# EasyEDA Pro project 旋变解码板_v2.2.epro, schematic schematic1_7

## Sheets
1 MCU: Create Date: 2024-06-20; Page Name: MCU; Project Name: underwaterJointControlBoard_0430; Schematic Name: schematic1_6; Update Date: 2024-06-20; Page Size: A4
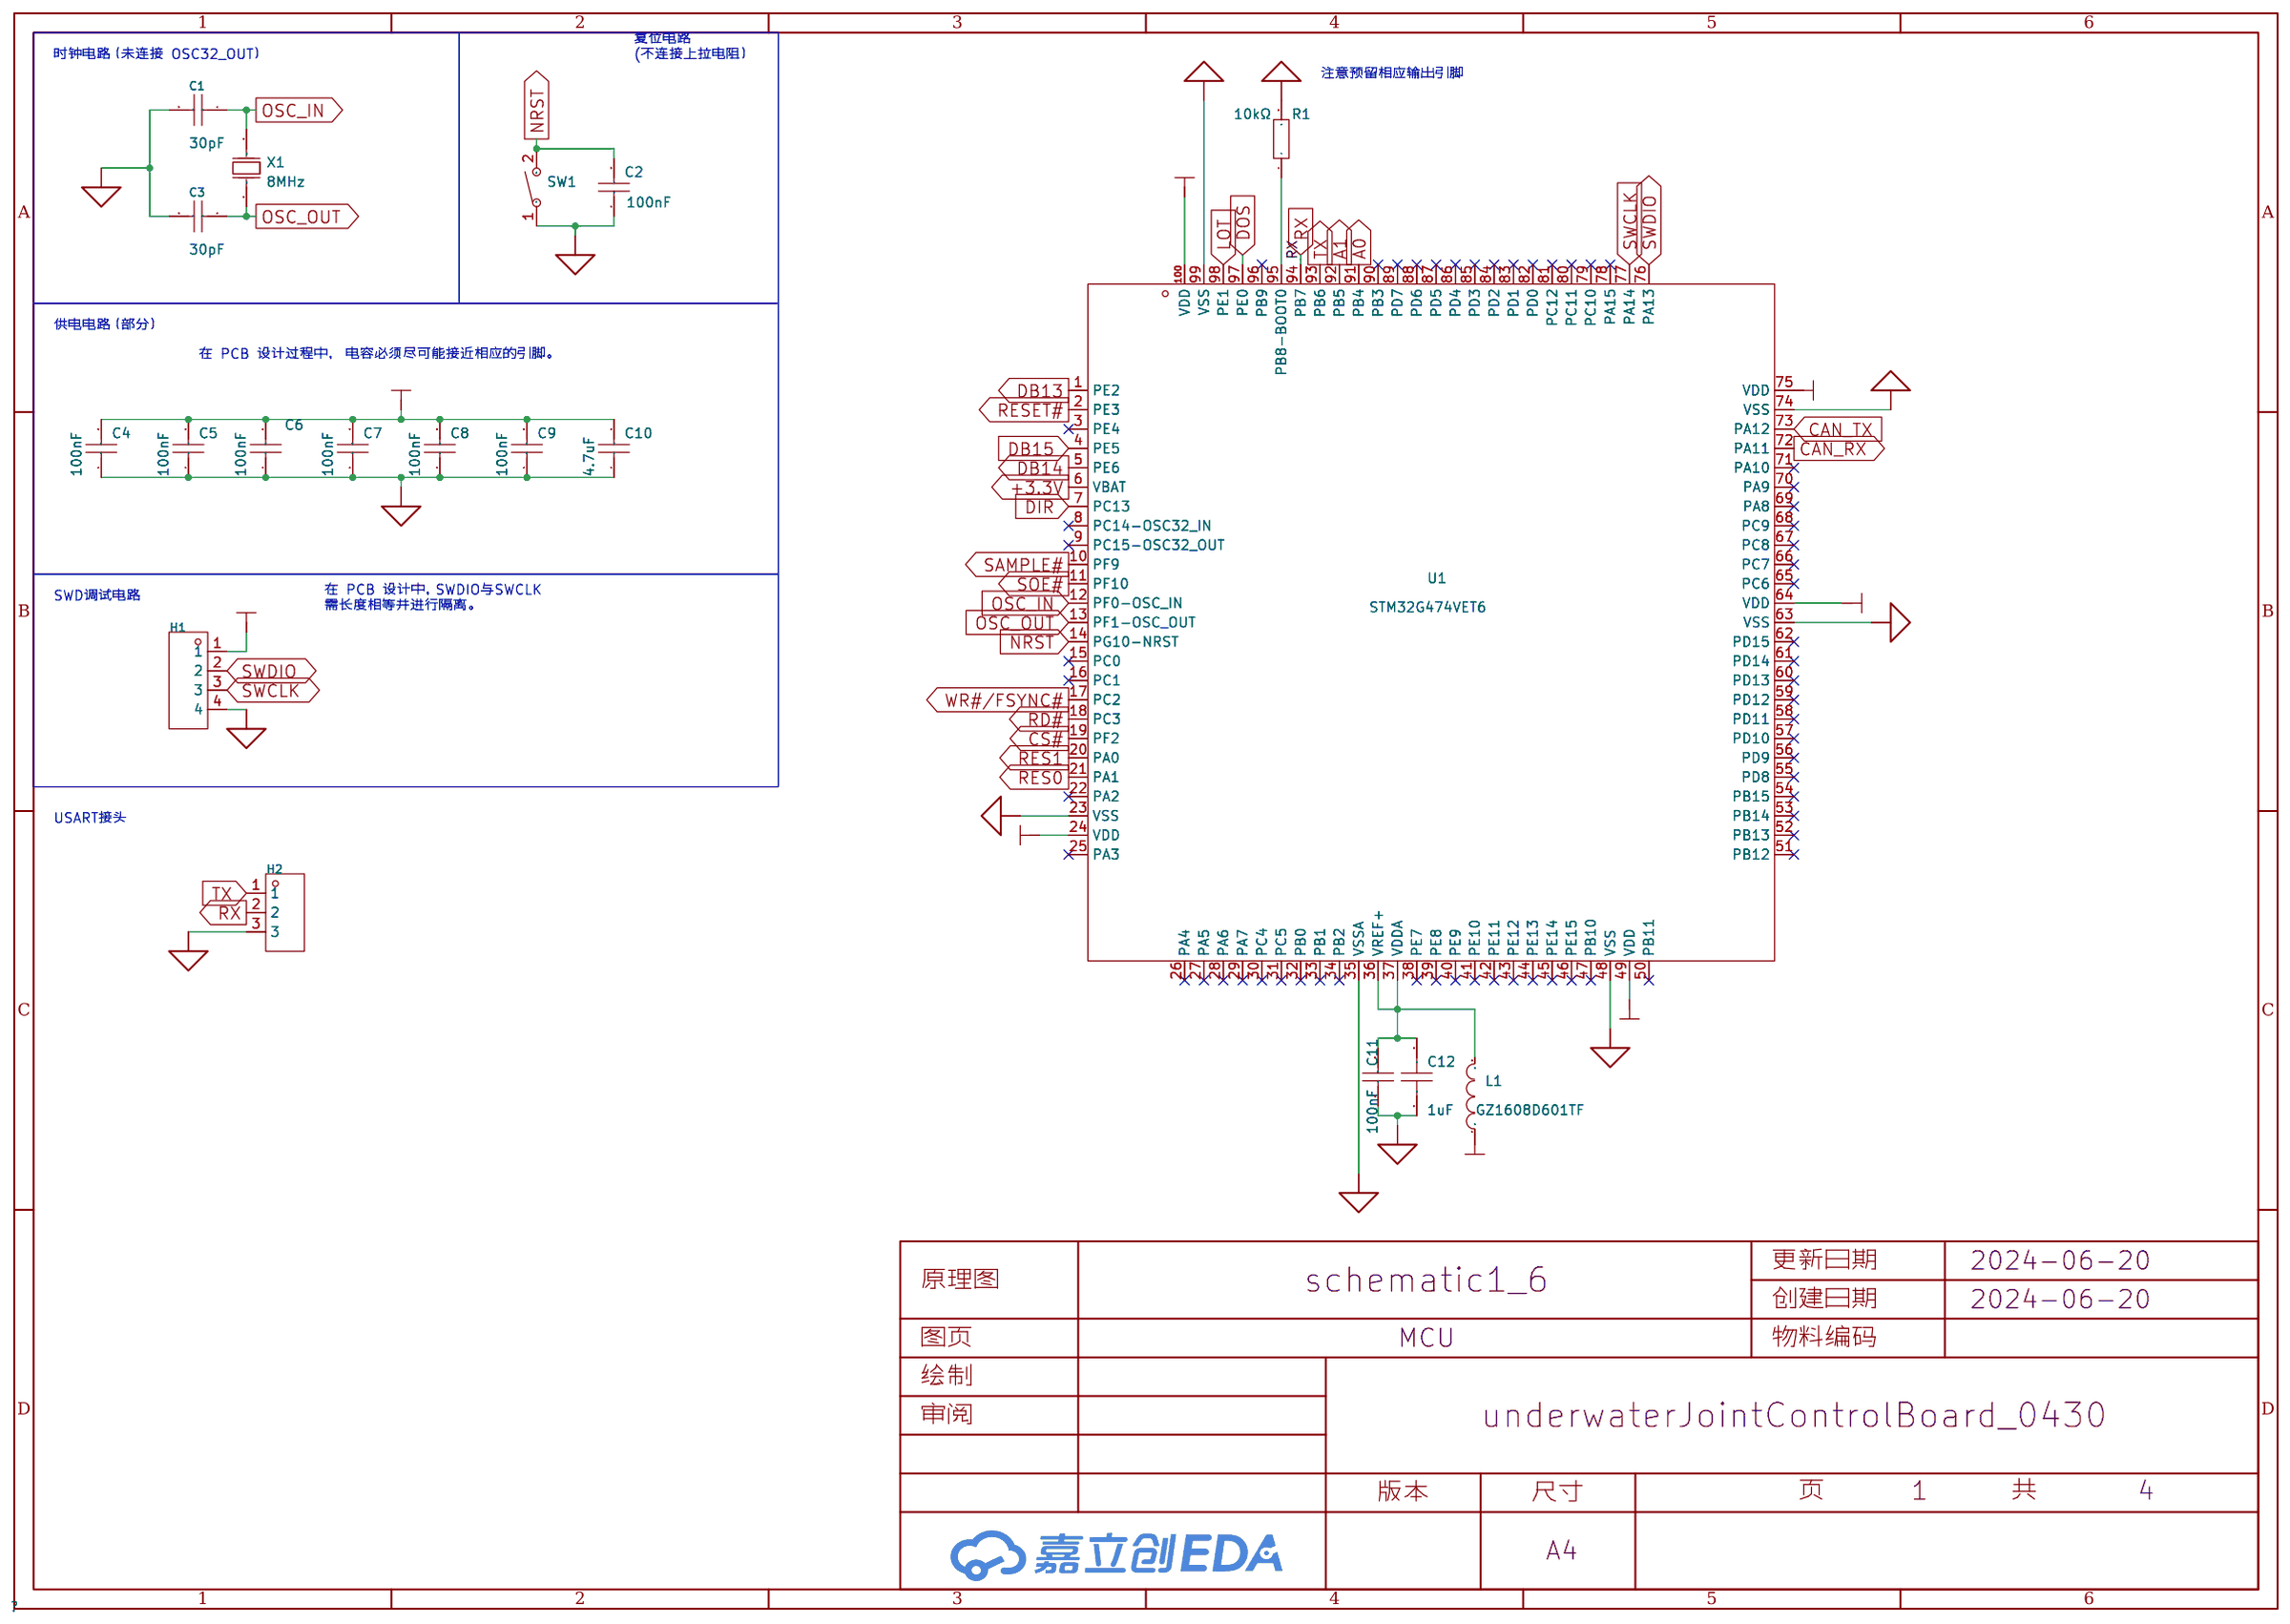
[diagram p0: MCU]
2 Power: Page Name: Power
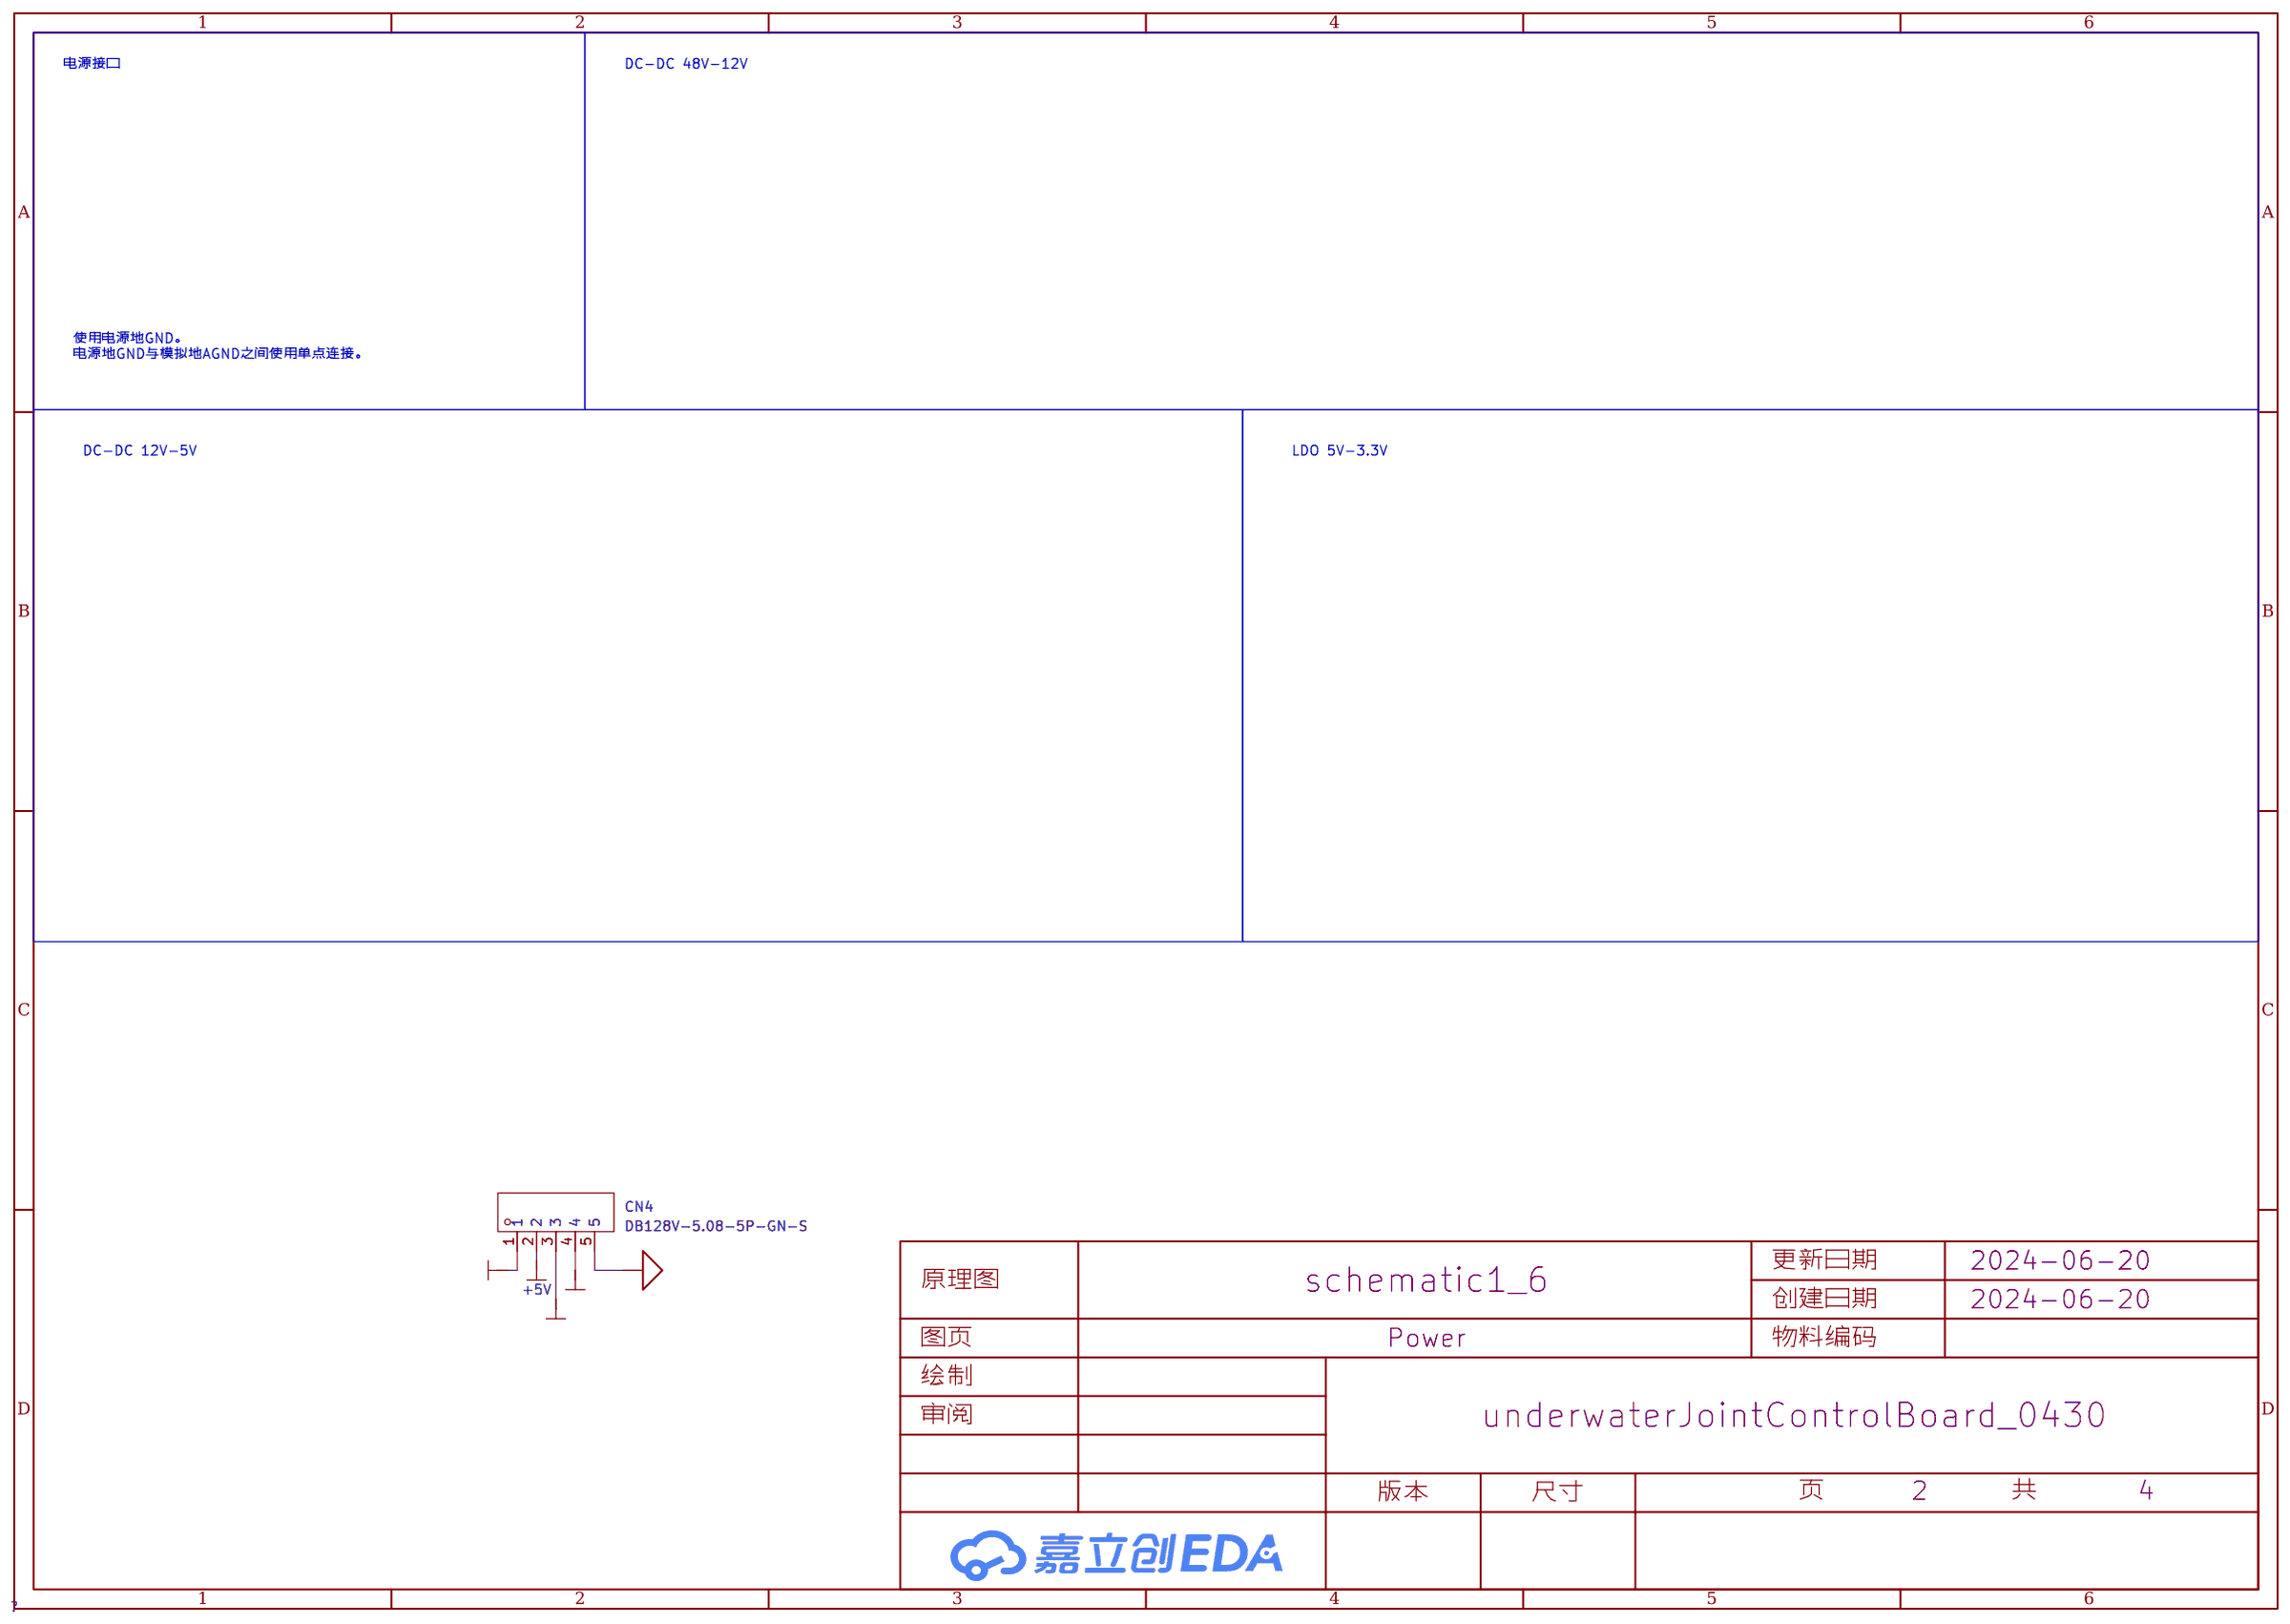
[diagram p1: Power]
3 Driver: Page Name: Driver
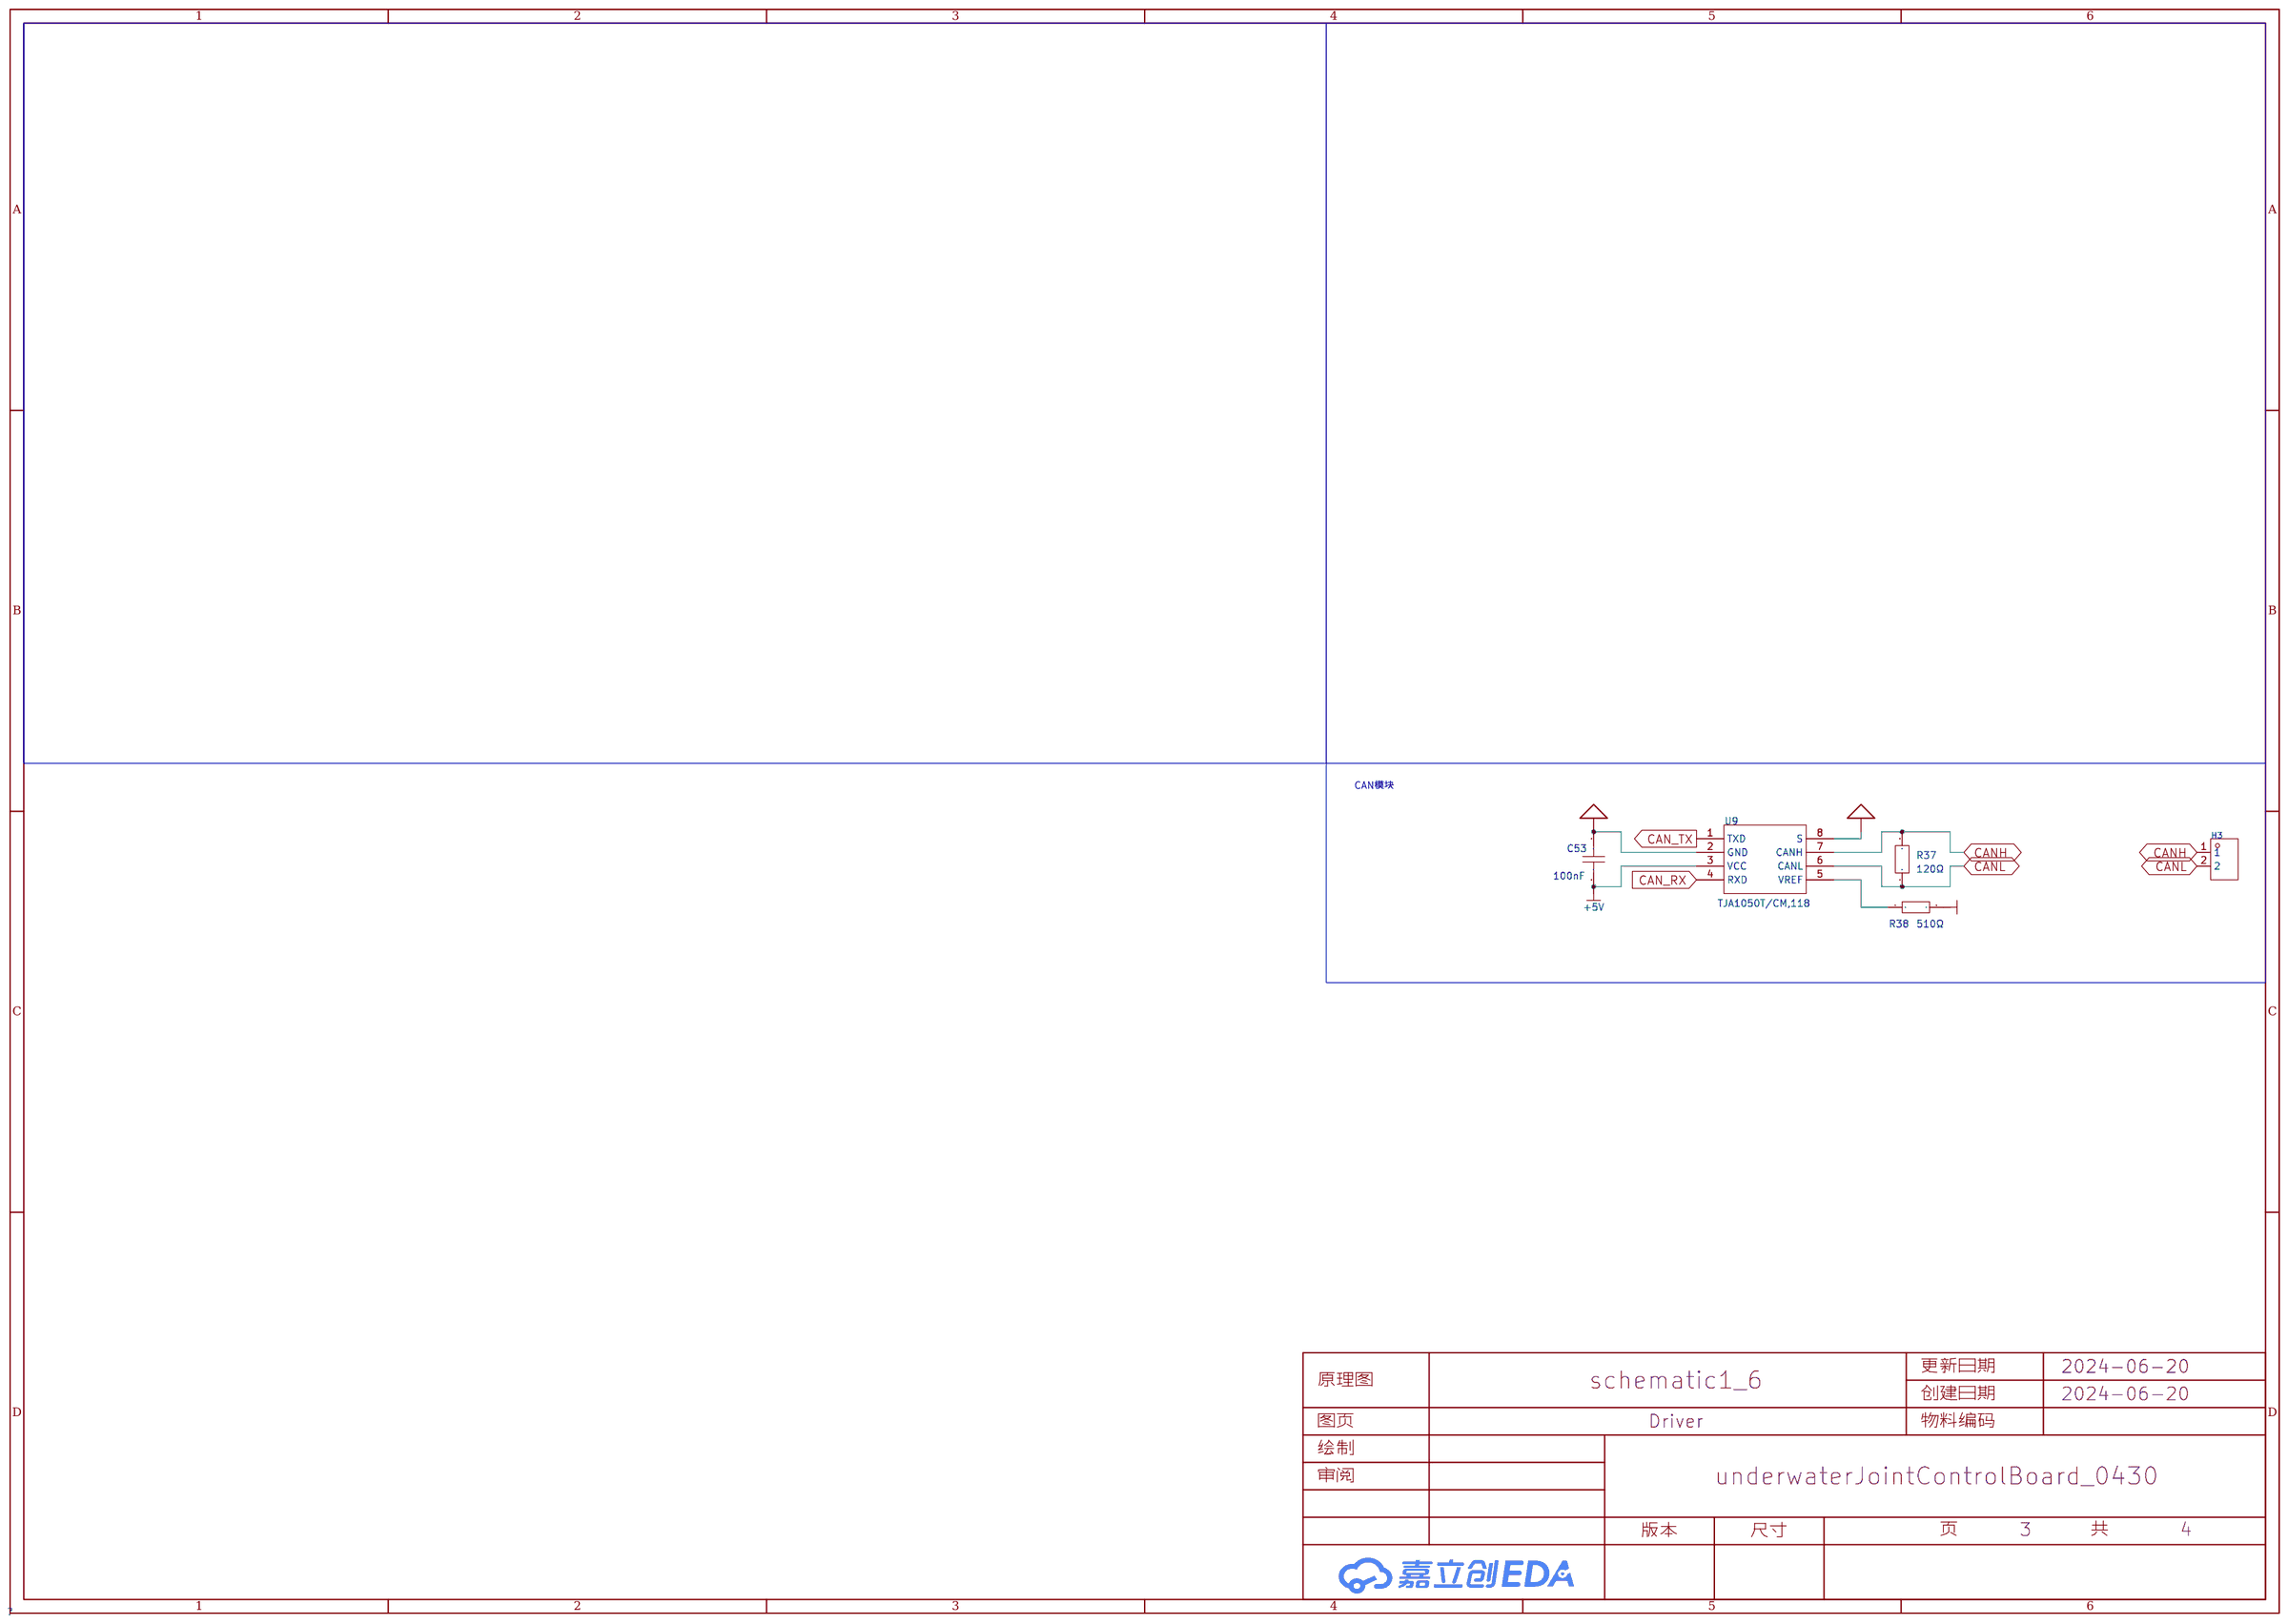
[diagram p2: Driver]
4 AD2S1210: Page Name: AD2S1210
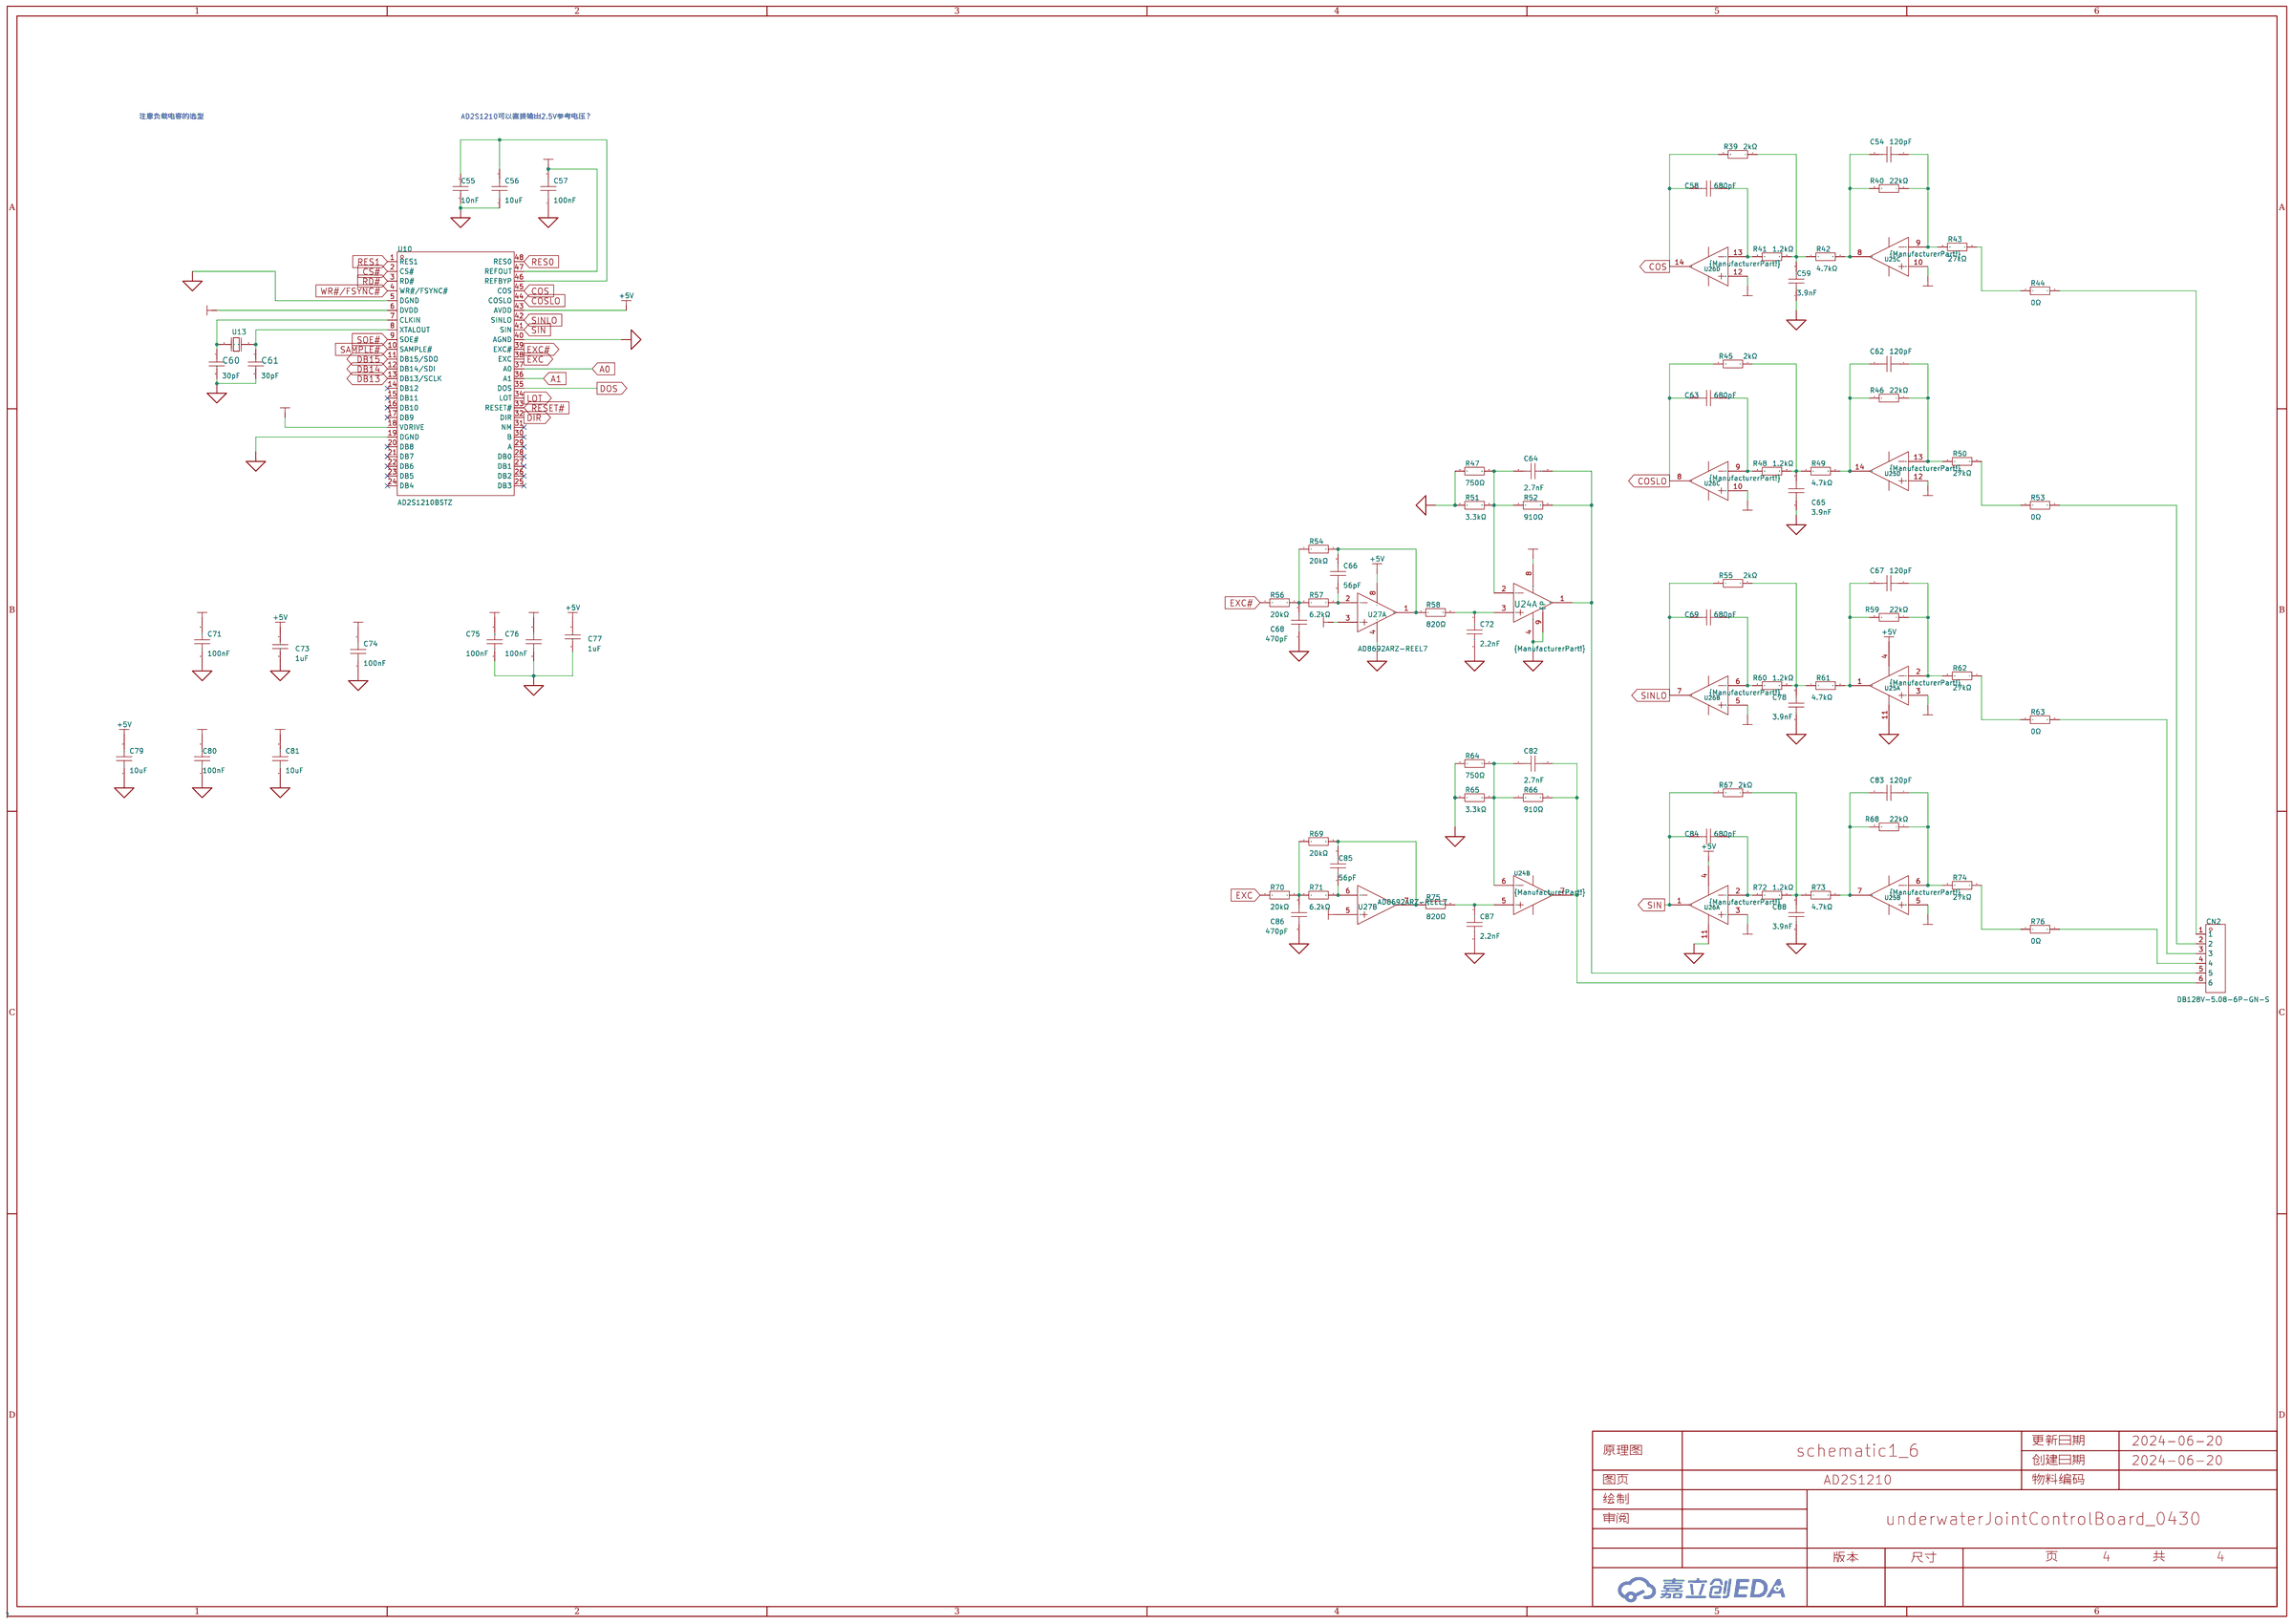
[diagram p3: AD2S1210]

## Parts
sheet AD2S1210
C54  120pF  [C0603]
C55  10nF  [C0603]
C56  10uF  [C0805]
C57  100nF  [C0805]
C58  680pF  [C0603]
C59  3.9nF  [C0805]
C60  30pF  [C0402]
C61  30pF  [C0402]
C62  120pF  [C0603]
C63  680pF  [C0603]
C64  2.7nF  [C0603]
C65  3.9nF  [C0805]
C66  56pF  [C0805]
C67  120pF  [C0603]
C68  470pF  [C0805]
C69  680pF  [C0603]
C71  100nF  [C0805]
C72  2.2nF  [C0805]
C73  1uF  [C0402]
C74  100nF  [C0805]
C75  100nF  [C0805]
C76  100nF  [C0805]
C77  1uF  [C0402]
C78  3.9nF  [C0805]
C79  10uF  [C0805]
C80  100nF  [C0805]
C81  10uF  [C0805]
C82  2.7nF  [C0603]
C83  120pF  [C0603]
C84  680pF  [C0603]
C85  56pF  [C0805]
C86  470pF  [C0805]
C87  2.2nF  [C0805]
C88  3.9nF  [C0805]
CN2  DB128V-5.08-6P-GN-S  [CONN-TH_6P-P5.08_DIBO_DB128V-5.08]
R39  2kΩ  [R0805]
R40  22kΩ  [R0805]
R41  1.2kΩ  [R0805]
R42  4.7kΩ  [R1206]
R43  27kΩ  [R0805]
R44  0Ω  [R0603]
R45  2kΩ  [R0805]
R46  22kΩ  [R0805]
R47  750Ω  [R1206]
R48  1.2kΩ  [R0805]
R49  4.7kΩ  [R1206]
R50  27kΩ  [R0805]
R51  3.3kΩ  [R0805]
R52  910Ω  [R0805]
R53  0Ω  [R0603]
R54  20kΩ  [R0805]
R55  2kΩ  [R0805]
R56  20kΩ  [R0805]
R57  6.2kΩ  [R0805]
R58  820Ω  [R0805]
R59  22kΩ  [R0805]
R60  1.2kΩ  [R0805]
R61  4.7kΩ  [R1206]
R62  27kΩ  [R0805]
R63  0Ω  [R0603]
R64  750Ω  [R1206]
R65  3.3kΩ  [R0805]
R66  910Ω  [R0805]
R67  2kΩ  [R0805]
R68  22kΩ  [R0805]
R69  20kΩ  [R0805]
R70  20kΩ  [R0805]
R71  6.2kΩ  [R0805]
R72  1.2kΩ  [R0805]
R73  4.7kΩ  [R1206]
R74  27kΩ  [R0805]
R75  820Ω  [R0805]
R76  0Ω  [R0603]
U10  AD2S1210BSTZ  [LQFP-48_L7.0-W7.0-P0.50-LS9.0-BL]
U13  TX49S8.192M2LDBE2S  [HC-49S_L11.5-W5.0-P4.88]
U24  -  [SOP-8_L4.9-W3.9-P1.27-LS6.0-BL-EP2.1]  (sections 1,2)
U25  -  [TSSOP-14_L5.0-W4.5-P0.65-LS6.4-BL]  (sections 1,2,3,4)
U26  -  [TSSOP-14_L5.0-W4.5-P0.65-LS6.4-BL]  (sections 1,2,3,4)
U27  AD8692ARZ-REEL7  [SOIC-8_L4.9-W3.9-P1.27-LS6.0-BL]  (sections 1,2)
sheet Driver
C53  100nF  [C0603]
H3  PZ254V-11-02P  [HDR-TH_2P-P2.54-V-M]
R37  120Ω  [R0603]
R38  510Ω  [R0402]
U9  TJA1050T/CM,118  [SOIC-8_L5.0-W4.0-P1.27-LS6.0-BL]
sheet MCU
C1  30pF  [C0402]
C2  100nF  [C0402]
C3  30pF  [C0402]
C4  100nF  [C0402]
C5  100nF  [C0402]
C6  100nF  [C0402]
C7  100nF  [C0402]
C8  100nF  [C0402]
C9  100nF  [C0402]
C10  4.7uF  [C0402]
C11  100nF  [C0402]
C12  1uF  [C0402]
H1  PZ254V-11-04P  [HDR-TH_4P-P2.54-V-M]
H2  PZ254V-11-03P  [HDR-TH_3P-P2.54-V-M]
L1  GZ1608D601TF  [L0603]
R1  10kΩ  [R0402]
SW1  TS-1185-B-B-B-A  [SW-SMD_L4.0-W3.0-LS5.0]
U1  STM32G474VET6  [LQFP-100_L14.0-W14.0-P0.50-LS16.0-BL]
X1  8MHz  [CRYSTAL-SMD_L5.0-W3.2]
sheet Power
CN4  DB128V-5.08-5P-GN-S  [CONN-TH_5P-P5.08_DIBO_DB128V-5.08-5P-GN-S]

## Library data of the parts
C54 C62 C67 C83 = CC0603JRNPO0BN121: 容值:120pF;精度:±5%;额定电压:100V;材质(温度系数):NP0;; LCSC Part Name: 120pF±5%100V; Supplier Part: C327221; Manufacturer: YAGEO(国巨); Supplier Footprint: 0603; JLCPCB Part Class: ExtendedPart; Datasheet: https://atta.szlcsc.com/upload/public/pdf/source/20181031/C327221_680D90F6C38A65635C08C74A7A312F20.pdf; Supplier: LCSC; Tolerance: ±5%; Voltage Rated: 100V; Temperature Coefficient: NP0; Check: false
C55 = CC0603KRX7R0BB103: 容值:10nF;精度:±10%;额定电压:100V;材质(温度系数):X7R;; LCSC Part Name: 10nF ±10% 100V; Supplier Part: C107059; Manufacturer: YAGEO(国巨); Supplier Footprint: 0603; JLCPCB Part Class: 扩展库; Datasheet: https://atta.szlcsc.com/upload/public/pdf/source/20180906/C282243_51A53A5345E69C6665D4E8CFC2B98E68.pdf; Supplier: LCSC; Tolerance: ±10%; Voltage Rated: 100V; Temperature Coefficient: X7R
C56 C79 C81 = GRM21BR61H106KE43L: 容值:10uF;精度:±10%;额定电压:50V;材质(温度系数):X5R;; LCSC Part Name: 10uF±10%50V; Supplier Part: C440198; Manufacturer: muRata(村田); Supplier Footprint: 0805; JLCPCB Part Class: BasicPart; Datasheet: https://atta.szlcsc.com/upload/public/pdf/source/20191220/C440198_2DEA1B9834E321C8893F7972E9DFE5B0.pdf; Supplier: LCSC; Tolerance: ±10%; Voltage Rated: 50V; Temperature Coefficient: X5R; Check: false
C57 C71 C74-C76 C80 = CC0805KRX7R8BB104: 容值:100nF;精度:±10%;额定电压:25V;材质(温度系数):X7R;; LCSC Part Name: 100nF ±10% 25V; Supplier Part: C519981; Manufacturer: YAGEO(国巨); Supplier Footprint: 0805; JLCPCB Part Class: 扩展库; Datasheet: https://atta.szlcsc.com/upload/public/pdf/source/20200423/C519981_E6F43661DB860428F2E3148C61460CC7.pdf; Supplier: LCSC; Tolerance: ±10%; Voltage Rated: 25V; Temperature Coefficient: X7R
C58 C63 C69 C84 = CC0603FRNPO9BN681: 容值:680pF;精度:±1%;额定电压:50V;材质(温度系数):NP0;; LCSC Part Name: 680pF ±1% 50V; Supplier Part: C519566; Manufacturer: YAGEO(国巨); Supplier Footprint: 0603; JLCPCB Part Class: 扩展库; Datasheet: https://atta.szlcsc.com/upload/public/pdf/source/20200423/C519566_5D3A12C3DA2F1ABF40C6D7FEFF7BFDAC.pdf; Supplier: LCSC; Tolerance: ±1%; Voltage Rated: 50V; Temperature Coefficient: NP0
C59 C65 C78 C88 = CC0805FKNPO9BN392: 容值:3.9nF;精度:±1%;额定电压:50V;材质(温度系数):NP0;; LCSC Part Name: 3.9nF ±1% 50V; Supplier Part: C541576; Manufacturer: YAGEO(国巨); Supplier Footprint: 0805; JLCPCB Part Class: 扩展库; Datasheet: https://atta.szlcsc.com/upload/public/pdf/source/20200615/C541576_0B893D293972150ED18C14856E8F7EBD.pdf; Supplier: LCSC; Tolerance: ±1%; Voltage Rated: 50V; Temperature Coefficient: NP0
C1 C3 C60 C61 = 0402CG300J500NT: 容值:30pF;精度:±5%;额定电压:50V;材质(温度系数):C0G;; LCSC Part Name: 30pF ±5% 50V; Supplier Part: C1570; Manufacturer: FH(风华); Supplier Footprint: 0402; JLCPCB Part Class: 扩展库; Supplier: LCSC; Tolerance: ±5%; Voltage Rated: 50V; Temperature Coefficient: C0G
C64 C82 = CC0603JRNPO9BN272: 容值:2.7nF;精度:±5%;额定电压:50V;材质(温度系数):NP0;; LCSC Part Name: 2.7nF ±5% 50V; Supplier Part: C326759; Manufacturer: YAGEO(国巨); Supplier Footprint: 0603; JLCPCB Part Class: 扩展库; Datasheet: https://atta.szlcsc.com/upload/public/pdf/source/20181031/C326759_13E6BDE3EDA14D7A28AC52A34A9AD44E.pdf; Supplier: LCSC; Tolerance: ±5%; Voltage Rated: 50V; Temperature Coefficient: NP0
C66 C85 = CC0805JRNPOABN560: 容值:56pF;精度:±5%;额定电压:200V;材质(温度系数):NP0;; LCSC Part Name: 56pF ±5% 200V; Supplier Part: C527210; Manufacturer: YAGEO(国巨); Supplier Footprint: 0805; JLCPCB Part Class: 扩展库; Datasheet: https://atta.szlcsc.com/upload/public/pdf/source/20200508/C527210_383B5093961B983DC86B949F6FEA2A17.pdf; Supplier: LCSC; Tolerance: ±5%; Voltage Rated: 200V; Temperature Coefficient: NP0
C68 C86 = 0805B471K101CT: 容值:470pF;精度:±10%;额定电压:100V;材质(温度系数):X7R;; LCSC Part Name: 470pF±10%100V; Supplier Part: C77469; Manufacturer: Walsin(华新科); Supplier Footprint: 0805; JLCPCB Part Class: ExtendedPart; Datasheet: https://atta.szlcsc.com/upload/public/pdf/source/20160702/1467448305297.pdf; Supplier: LCSC; Tolerance: ±10%; Voltage Rated: 100V; Temperature Coefficient: X7R; Check: false
C72 C87 = CL21C222JBFNNNE: 容值:2.2nF;精度:±5%;额定电压:50V;材质(温度系数):C0G;; LCSC Part Name: 2.2nF±5%50V; Supplier Part: C28260; Manufacturer: SAMSUNG(三星); Supplier Footprint: 0805; JLCPCB Part Class: BasicPart; Datasheet: https://atta.szlcsc.com/upload/public/pdf/source/20160103/1457707717122.pdf; Supplier: LCSC; Tolerance: ±5%; Voltage Rated: 50V; Temperature Coefficient: C0G; Check: false
C73 C77 = CL05A105KP5NNNC: 容值:1uF;精度:±10%;额定电压:10V;材质(温度系数):X5R;; LCSC Part Name: 1uF ±10% 10V; Supplier Part: C14445; Manufacturer: SAMSUNG(三星); Supplier Footprint: 0402; JLCPCB Part Class: 扩展库; Datasheet: https://atta.szlcsc.com/upload/public/pdf/source/20160218/1457707763339.pdf; Supplier: LCSC; Tolerance: ±10%; Voltage Rated: 10V; Temperature Coefficient: X5R
CN2 = DB128V-5.08-6P-GN-S: 结构:1x6P;间距:5.08mm;颜色:绿色;安装方式:直插;额定电流:20A;额定电压:300V;排数:1;线规 - AWG:12~30;线规 - 平方毫米:2.5;每排PIN数:6;工作温度范围:-40℃~+105℃;; LCSC Part Name: 5.08mm 1x6P 排数:1 每排P数:6 直插; Supplier Part: C2915642; Manufacturer: DORABO(地博电气); Supplier Footprint: 插件,P=5.08mm; JLCPCB Part Class: 扩展库; Datasheet: https://atta.szlcsc.com/upload/public/pdf/source/20230106/CC449C10514519CDCE20F1C37DBF2DAC.pdf; Supplier: LCSC; Structure: 1x6P; Pitch: 5.08mm; Color: 绿色; Mounting Style: 直插; Current Rating (Max): 20A; Voltage Rating (Max): 300V; Number of Pins: 6P; Number of Rows: 1; Wire Gauge - AWG: 12~30; Wire Gauge - mm2: 2.5; Number of PINs Per Row: 6; Operating Temperature Range: -40℃~+105℃
R39 R45 R55 R67 = 0805W8F2001T5E: 电阻类型:厚膜电阻;阻值:2kΩ;精度:±1%;功率:125mW;; LCSC Part Name: 2kΩ±1%125mW; Supplier Part: C17604; Manufacturer: UNI-ROYAL(厚声); Supplier Footprint: 0805; JLCPCB Part Class: BasicPart; Datasheet: https://atta.szlcsc.com/upload/public/pdf/source/20200306/C422600_1E6D84923E4A46A82E41ADD87F860B5C.pdf; Supplier: LCSC; Type: 厚膜电阻; Tolerance: ±1%; Power(Watts): 125mW; Temperature Coefficient: ±100ppm/℃; Overload Voltage (Max): 150V; Operating Temperature Range: -55℃~+155℃; Check: false
R40 R46 R59 R68 = HPCR0805F22K0K9: 电阻类型:厚膜电阻;阻值:22kΩ;精度:±1%;功率:250mW;; LCSC Part Name: 22kΩ±1%250mW; Supplier Part: C365267; Manufacturer: RESI(开步睿思）; Supplier Footprint: 0805; JLCPCB Part Class: ExtendedPart; Datasheet: https://atta.szlcsc.com/upload/public/pdf/source/20190129/C365267_22324DFAC73ACC8C479E47CFCF1B17DC.pdf; Supplier: LCSC; Type: 厚膜电阻; Tolerance: ±1%; Power(Watts): 250mW; Temperature Coefficient: ±100ppm/℃; Overload Voltage (Max): 150V; Operating Temperature Range: -55℃~+125℃; Check: false
R41 R48 R60 R72 = RK73H2ATTD1201F: 电阻类型:厚膜电阻;阻值:1.2kΩ;精度:±1%;功率:250mW;; LCSC Part Name: 1.2kΩ ±1% 250mW; Supplier Part: C317262; Manufacturer: KOA; Supplier Footprint: 0805; JLCPCB Part Class: 扩展库; Datasheet: https://atta.szlcsc.com/upload/public/pdf/source/20190109/C317262_42154AA67A5EBCEACC7F2531CD197D56.pdf; Supplier: LCSC; Type: 厚膜电阻; Tolerance: ±1%; Power(Watts): 250mW; Temperature Coefficient: ±100ppm/℃; Overload Voltage (Max): 150V; Operating Temperature Range: -55℃~+155℃
R42 R49 R61 R73 = 1206W4J0472T5E: 阻值:4.7kΩ;精度:±5%;功率:250mW;温度系数:±100ppm/℃;电阻类型:厚膜电阻;; LCSC Part Name: 4.7kΩ ±5% 250mW 厚膜电阻; Supplier Part: C26043; Manufacturer: UNI-ROYAL(厚声); Supplier Footprint: 1206; JLCPCB Part Class: 扩展库; Datasheet: https://atta.szlcsc.com/upload/public/pdf/source/20200306/C422600_1E6D84923E4A46A82E41ADD87F860B5C.pdf; Supplier: LCSC; Tolerance: ±5%; Power(Watts): 250mW; Overload Voltage (Max): 200V; Temperature Coefficient: ±100ppm/℃; Type: 厚膜电阻; Operating Temperature Range: -55℃~+155℃
R43 R50 R62 R74 = 0805W8F2702T5E: 电阻类型:厚膜电阻;阻值:27kΩ;精度:±1%;功率:125mW;; LCSC Part Name: 27kΩ±1%125mW; Supplier Part: C17593; Manufacturer: UNI-ROYAL(厚声); Supplier Footprint: 0805; JLCPCB Part Class: BasicPart; Datasheet: https://atta.szlcsc.com/upload/public/pdf/source/20200306/C422600_1E6D84923E4A46A82E41ADD87F860B5C.pdf; Supplier: LCSC; Type: 厚膜电阻; Tolerance: ±1%; Power(Watts): 125mW; Temperature Coefficient: ±100ppm/℃; Overload Voltage (Max): 150V; Operating Temperature Range: -55℃~+155℃; Check: false
R44 R53 R63 R76 = 0603WAF0000T5E: 阻值:0Ω;精度:±1%;功率:100mW;电阻类型:厚膜电阻;; LCSC Part Name: 0Ω ±1% 100mW 厚膜电阻; Supplier Part: C21189; Manufacturer: UNI-ROYAL(厚声); Supplier Footprint: 0603; JLCPCB Part Class: 基础库; Datasheet: https://atta.szlcsc.com/upload/public/pdf/source/20200306/C422600_1E6D84923E4A46A82E41ADD87F860B5C.pdf; Supplier: LCSC; Tolerance: ±1%; Power(Watts): 100mW; Overload Voltage (Max): 75V; Type: 厚膜电阻; Operating Temperature Range: -55℃~+155℃
R47 R64 = 1206W4F7500T5E: 阻值:750Ω;精度:±1%;功率:250mW;温度系数:±100ppm/℃;电阻类型:厚膜电阻;; LCSC Part Name: 750Ω ±1% 250mW 厚膜电阻; Supplier Part: C17985; Manufacturer: UNI-ROYAL(厚声); Supplier Footprint: 1206; JLCPCB Part Class: 扩展库; Datasheet: https://atta.szlcsc.com/upload/public/pdf/source/20200306/C422600_1E6D84923E4A46A82E41ADD87F860B5C.pdf; Supplier: LCSC; Tolerance: ±1%; Power(Watts): 250mW; Overload Voltage (Max): 200V; Temperature Coefficient: ±100ppm/℃; Type: 厚膜电阻; Operating Temperature Range: -55℃~+155℃
R51 R65 = 0805W8F3301T5E: 电阻类型:厚膜电阻;阻值:3.3kΩ;精度:±1%;功率:125mW;; LCSC Part Name: 3.3kΩ±1%125mW; Supplier Part: C26010; Manufacturer: UNI-ROYAL(厚声); Supplier Footprint: 0805; JLCPCB Part Class: BasicPart; Datasheet: https://atta.szlcsc.com/upload/public/pdf/source/20200306/C422600_1E6D84923E4A46A82E41ADD87F860B5C.pdf; Supplier: LCSC; Type: 厚膜电阻; Tolerance: ±1%; Power(Watts): 125mW; Temperature Coefficient: ±100ppm/℃; Overload Voltage (Max): 150V; Operating Temperature Range: -55℃~+155℃; Check: false
R52 R66 = 0805W8F9100T5E: 电阻类型:厚膜电阻;阻值:910Ω;精度:±1%;功率:125mW;; LCSC Part Name: 910Ω±1%125mW; Supplier Part: C17865; Manufacturer: UNI-ROYAL(厚声); Supplier Footprint: 0805; JLCPCB Part Class: ExtendedPart; Datasheet: https://atta.szlcsc.com/upload/public/pdf/source/20200306/C422600_1E6D84923E4A46A82E41ADD87F860B5C.pdf; Supplier: LCSC; Type: 厚膜电阻; Tolerance: ±1%; Power(Watts): 125mW; Temperature Coefficient: ±100ppm/℃; Overload Voltage (Max): 150V; Operating Temperature Range: -55℃~+155℃; Check: false
R54 R56 R69 R70 = 0805W8F2002T5E: 电阻类型:厚膜电阻;阻值:20kΩ;精度:±1%;功率:125mW;; LCSC Part Name: 20kΩ±1%125mW; Supplier Part: C4328; Manufacturer: UNI-ROYAL(厚声); Supplier Footprint: 0805; JLCPCB Part Class: BasicPart; Datasheet: https://atta.szlcsc.com/upload/public/pdf/source/20200306/C422600_1E6D84923E4A46A82E41ADD87F860B5C.pdf; Supplier: LCSC; Type: 厚膜电阻; Tolerance: ±1%; Power(Watts): 125mW; Temperature Coefficient: ±100ppm/℃; Overload Voltage (Max): 150V; Operating Temperature Range: -55℃~+155℃
R57 R71 = 0805W8F6201T5E: 电阻类型:厚膜电阻;阻值:6.2kΩ;精度:±1%;功率:125mW;; LCSC Part Name: 6.2kΩ±1%125mW; Supplier Part: C17767; Manufacturer: UNI-ROYAL(厚声); Supplier Footprint: 0805; JLCPCB Part Class: BasicPart; Datasheet: https://atta.szlcsc.com/upload/public/pdf/source/20200306/C422600_1E6D84923E4A46A82E41ADD87F860B5C.pdf; Supplier: LCSC; Type: 厚膜电阻; Tolerance: ±1%; Power(Watts): 125mW; Temperature Coefficient: ±100ppm/℃; Overload Voltage (Max): 150V; Operating Temperature Range: -55℃~+155℃; Check: false
R58 R75 = 0805W8F8200T5E: 电阻类型:厚膜电阻;阻值:820Ω;精度:±1%;功率:125mW;; LCSC Part Name: 820Ω±1%125mW; Supplier Part: C17837; Manufacturer: UNI-ROYAL(厚声); Supplier Footprint: 0805; JLCPCB Part Class: BasicPart; Datasheet: https://atta.szlcsc.com/upload/public/pdf/source/20200306/C422600_1E6D84923E4A46A82E41ADD87F860B5C.pdf; Supplier: LCSC; Type: 厚膜电阻; Tolerance: ±1%; Power(Watts): 125mW; Temperature Coefficient: ±100ppm/℃; Overload Voltage (Max): 150V; Operating Temperature Range: -55℃~+155℃; Check: false
U10 = AD2S1210BSTZ: 接口:-;差分输入:-;通道数:-;积分非线性:-;采样率:-;分辨率:-;电源电压:4.75V~5.25V;工作温度:-;; Supplier Part: C408404; Manufacturer: ADI(亚德诺)/LINEAR(凌特); Supplier Footprint: LQFP-48; JLCPCB Part Class: ExtendedPart; Datasheet: https://atta.szlcsc.com/upload/public/pdf/source/20190729/C408404_5CC82670C2636817AFBB1B72398BE3F6.pdf; Supplier: LCSC; Supply Voltage: 4.75V~5.25V; Check: false
U13 = TX49S8.192M2LDBE2S: 频率：8.192MHz频率公差：±20ppm频率稳定度：±30ppm负载电容：20F工作温度：-20℃~+70℃; LCSC Part Name: 49S8.192MHz±20ppm20pF; Supplier Part: C5339096; Manufacturer: TAE(雅晶鑫); Supplier Footprint: HC-49S; Datasheet: https://atta.szlcsc.com/upload/public/pdf/source/20221227/B9CD1547918608DAAB88F1EEC9394DFF.pdf; Supplier: LCSC; Crystal Type: 49S晶振; Check: false
U24 = AD8397ARDZ-REEL7: 放大器组数:2;带宽(-3db):69MHz;输入偏置电流(Ib):200pA;增益带宽积(GBP):35MHz;压摆率(SR):53V/us;; Supplier Part: C90876; Manufacturer: ADI(亚德诺); Supplier Footprint: SOIC-8-EP; JLCPCB Part Class: ExtendedPart; Datasheet: https://atta.szlcsc.com/upload/public/pdf/source/20191204/C90876_4AF00728A23BB3AF24EDE9E3A75C9AF8.pdf; Supplier: LCSC; Number of Circuits: 2; -3db Bandwidth: 69MHz; Current - Input Bias(Ib): 200pA; Gain Bandwidth Product(GBP): 35MHz; Slew Rate(SR): 53V/us; Output Current: 310mA; Operating Temperature: -40℃~+85℃
U25 U26 = AD8694ARUZ: 通用-放大器-4-电路-满摆幅-14-TSSOP; Supplier Part: C653152; Manufacturer: ADI(亚德诺)/LINEAR(凌特); Supplier Footprint: TSSOP-14; JLCPCB Part Class: ExtendedPart; Datasheet: https://atta.szlcsc.com/upload/public/pdf/source/20140724/1457707164435.pdf; Supplier: LCSC
U27 = AD8692ARZ-REEL7: 放大器组数:2;; Supplier Part: C90875; Manufacturer: ADI(亚德诺)/LINEAR(凌特); Supplier Footprint: SOIC-8; JLCPCB Part Class: 扩展库; Datasheet: https://atta.szlcsc.com/upload/public/pdf/source/20161226/1482720160196.pdf; Supplier: LCSC; Number of Circuits: 2
C53 = CC0603KRX7R9BB104: 容值:100nF;精度:±10%;额定电压:50V;材质(温度系数):X7R;; LCSC Part Name: 100nF ±10% 50V; Supplier Part: C14663; Manufacturer: YAGEO(国巨); Supplier Footprint: 0603; JLCPCB Part Class: 基础库; Datasheet: https://atta.szlcsc.com/upload/public/pdf/source/20180910/C282072_33301C7F631E79921B82A8DAC6BCC5B3.pdf; Supplier: LCSC; Tolerance: ±10%; Voltage Rated: 50V; Temperature Coefficient: X7R
H3 = PZ254V-11-02P: 排数:单排;总PIN位数:2P;间距:2.54mm;插针结构:1x2P;行距:-;安装类型:直插;圆针/方针:方针;额定电流:-;额定电压:-;配合针长度:6mm;塑高:2.5mm;端接针长度:3mm;触头材质:黄铜;触头镀层:-;工作温度范围:-40℃~+105℃;颜色:黑色;; LCSC Part Name: 2.54mm 1x2P 直插 方针; Supplier Part: C492401; Manufacturer: XFCN(兴飞); Supplier Footprint: 插件,P=2.54mm; JLCPCB Part Class: 扩展库; Datasheet: https://atta.szlcsc.com/upload/public/pdf/source/20200309/C492401_A812433581A9B211A7FFA413ADDFF0E5.pdf; Supplier: LCSC; Number of Rows: 单排; Number of Pins: 2P; Pitch: 2.54mm; Pin Structure: 1x2P; Mounting Type: 直插; Circluar Pins/Square Pins: 方针; Length of Mating Pin: 6mm; Insulation Height: 2.5mm; Length of End Connection Pin: 3mm; Contact Material: 黄铜; Operating Temperature Range: -40℃~+105℃; Color: 黑色
R37 = ERJPA3J121V: 阻值:120Ω;精度:±5%;功率:250mW;温度系数:±200ppm/℃;电阻类型:厚膜电阻;; LCSC Part Name: 120Ω ±5% 250mW 厚膜电阻; Supplier Part: C445808; Manufacturer: PANASONIC(松下); Supplier Footprint: 0603; JLCPCB Part Class: 扩展库; Datasheet: https://atta.szlcsc.com/upload/public/pdf/source/20191108/C445866_CA3143DB612218EAD038C79F733E1EE0.pdf; Supplier: LCSC; Tolerance: ±5%; Power(Watts): 250mW; Temperature Coefficient: ±200ppm/℃; Type: 厚膜电阻; Operating Temperature Range: -55℃~+155℃
R38 = 0402WGF5100TCE: 阻值:510Ω;精度:±1%;功率:62.5mW;温度系数:±100ppm/℃;电阻类型:厚膜电阻;; LCSC Part Name: 510Ω ±1% 62.5mW 厚膜电阻; Supplier Part: C25123; Manufacturer: UNI-ROYAL(厚声); Supplier Footprint: 0402; JLCPCB Part Class: 基础库; Datasheet: https://atta.szlcsc.com/upload/public/pdf/source/20200306/C422600_1E6D84923E4A46A82E41ADD87F860B5C.pdf; Supplier: LCSC; Tolerance: ±1%; Power(Watts): 62.5mW; Overload Voltage (Max): 50V; Temperature Coefficient: ±100ppm/℃; Type: 厚膜电阻; Operating Temperature Range: -55℃~+155℃
U9 = TJA1050T/CM,118: 类型:收发器;; LCSC Part Name: 4.75V~5.25V; Supplier Part: C6952; Manufacturer: NXP(恩智浦); Supplier Footprint: SOIC-8; JLCPCB Part Class: 扩展库; Datasheet: https://atta.szlcsc.com/upload/public/pdf/source/20140411/1457707042917.pdf; Supplier: LCSC; Type: 收发器; Supply Voltage: 4.75V~5.25V; Supply Current: 50mA
C2 C4-C9 C11 = CL05B104KO5NNNC: 容值:100nF;精度:±10%;额定电压:16V;材质(温度系数):X7R;; LCSC Part Name: 100nF ±10% 16V; Supplier Part: C1525; Manufacturer: SAMSUNG(三星); Supplier Footprint: 0402; JLCPCB Part Class: 基础库; Datasheet: https://atta.szlcsc.com/upload/public/pdf/source/20160218/1457707763339.pdf; Supplier: LCSC; Tolerance: ±10%; Voltage Rated: 16V; Temperature Coefficient: X7R
C10 = CL05A475MP5NRNC: 容值:4.7uF;精度:±20%;额定电压:10V;材质(温度系数):X5R;; LCSC Part Name: 4.7uF ±20% 10V; Supplier Part: C23733; Manufacturer: SAMSUNG(三星); Supplier Footprint: 0402; JLCPCB Part Class: 基础库; Datasheet: https://atta.szlcsc.com/upload/public/pdf/source/20160103/1457707710457.pdf; Supplier: LCSC; Tolerance: ±20%; Voltage Rated: 10V; Temperature Coefficient: X5R
C12 = CL05A105KA5NQNC: 容值:1uF;精度:±10%;额定电压:25V;材质(温度系数):X5R;; LCSC Part Name: 1uF ±10% 25V; Supplier Part: C52923; Manufacturer: SAMSUNG(三星); Supplier Footprint: 0402; JLCPCB Part Class: 基础库; Datasheet: https://atta.szlcsc.com/upload/public/pdf/source/20160103/1457707735223.pdf; Supplier: LCSC; Tolerance: ±10%; Voltage Rated: 25V; Temperature Coefficient: X5R
H1 = PZ254V-11-04P: 排数:单排;总PIN位数:4P;间距:2.54mm;插针结构:1x4P;行距:-;安装类型:直插;圆针/方针:方针;额定电流:3A;额定电压:250V;配合针长度:6mm;塑高:2.5mm;端接针长度:3mm;触头材质:-;工作温度范围:-40℃~+105℃;颜色:黑色;; LCSC Part Name: 2.54mm 1x4P 直插 方针; Supplier Part: C2691448; Manufacturer: XFCN(兴飞); Supplier Footprint: 插件,P=2.54mm; JLCPCB Part Class: 扩展库; Datasheet: https://atta.szlcsc.com/upload/public/pdf/source/20200309/C492403_F9F19131791D08044AD4F84F8E751A34.pdf; Supplier: LCSC; Number of Rows: 单排; Number of Pins: 4P; Pitch: 2.54mm; Pin Structure: 1x4P; Mounting Type: 直插; Circluar Pins/Square Pins: 方针; Current Rating (Max): 3A; Voltage Rating (Max): 250V; Length of Mating Pin: 6mm; Insulation Height: 2.5mm; Length of End Connection Pin: 3mm; Operating Temperature Range: -40℃~+105℃; Color: 黑色
H2 = PZ254V-11-03P: 排数:单排;总PIN位数:3;间距:2.54mm;插针结构:1x3P;行距:-;安装类型:直插;圆针/方针:方针;额定电流:3A;额定电压:250V;配合针长度:6mm;塑高:2.5mm;端接针长度:3mm;工作温度范围:-40℃~+105℃;颜色:黑色;; LCSC Part Name: 2.54mm 1x3P 直插 方针; Supplier Part: C2937625; Manufacturer: XFCN(兴飞); Supplier Footprint: 直插,P=2.54mm; JLCPCB Part Class: 扩展库; Datasheet: 2022-07-12/581362A/62b9d00620994b3696be7eb4af85ad72/双排排针和单排排针.pdf; Supplier: LCSC; Number of Rows: 单排; Number of Pins: 3; Pitch: 2.54mm; Pin Structure: 1x3P; Mounting Type: 直插; Circluar Pins/Square Pins: 方针; Current Rating (Max): 3A; Voltage Rating (Max): 250V; Length of Mating Pin: 6mm; Insulation Height: 2.5mm; Length of End Connection Pin: 3mm; Operating Temperature Range: -40℃~+105℃; Color: 黑色
L1 = GZ1608D601TF: 标称阻抗@测试频率:600Ω@100MHz;误差:±25%;直流电阻(RDC):450mΩ;; LCSC Part Name: 单路 0603磁珠 阻抗600Ω@100MHz; Supplier Part: C1002; Manufacturer: Sunlord(顺络); Supplier Footprint: 0603; JLCPCB Part Class: 基础库; Datasheet: https://atta.szlcsc.com/upload/public/pdf/source/20210830/355EA7C0FAC5394FC0FE3F17C770C20A.pdf; Supplier: LCSC; Impedance @ Frequency: 600Ω@100MHz; Tolerance: ±25%; DC Resistance: 450mΩ; Current Rating: 200mA; Circuits: 1
R1 = 0402WGF1002TCE: 阻值:10kΩ;精度:±1%;功率:62.5mW;温度系数:±100ppm/℃;电阻类型:厚膜电阻;; LCSC Part Name: 10kΩ ±1% 62.5mW 厚膜电阻; Supplier Part: C25744; Manufacturer: UNI-ROYAL(厚声); Supplier Footprint: 0402; JLCPCB Part Class: 基础库; Datasheet: https://atta.szlcsc.com/upload/public/pdf/source/20200306/C422600_1E6D84923E4A46A82E41ADD87F860B5C.pdf; Supplier: LCSC; Tolerance: ±1%; Power(Watts): 62.5mW; Overload Voltage (Max): 50V; Temperature Coefficient: ±100ppm/℃; Type: 厚膜电阻; Operating Temperature Range: -55℃~+155℃
SW1 = TS-1185-B-B-B-A: 触点电流:50mA;额定电压(DC):12V;绝缘电阻:-;电路结构:单刀单掷;安装方式:立贴;带灯:无;作用力:160gf;机械寿命:10万次;带支架:否;; LCSC Part Name: 立贴 3*4*2.5mm 轻触开关; Supplier Part: C561521; Manufacturer: XKB Connectivity(中国星坤); Supplier Footprint: SMD; JLCPCB Part Class: 扩展库; Datasheet: https://atta.szlcsc.com/upload/public/pdf/source/20211011/C2F26DC0AE1820400F54DBF49644F5A1.pdf; Supplier: LCSC; Contact Current: 50mA; Voltage Rating (DC): 12V; Circuit: 单刀单掷; Mounting Style: 立贴; Actuator Style: 圆形按钮; Actuator/Cap Color: 黑色; With Lamp: 无; Operating Force: 160gf; Mechanical Life: 10万次; Operating Temperature: -30℃~+85℃; Switch Length: 3mm; Switch Width: 4mm; Switch Height: 2.5mm; Strike Gundam: 否
U1 = STM32G474VET6: CPU内核:ARM Cortex-M4;CPU最大主频:170MHz;工作电压范围:1.71V~3.6V;内部振荡器:有;程序 FLASH容量:512K@x8bit;RAM总容量:128KB;EEPROM/数据 FLASH容量:-;GPIO端口数量:86;ADC(单元数/通道数/位数):1@x42ch/12bit;DAC(单元数/通道数/位数):1@x7ch/12bit;外设/功能/协议栈:DMA；PWM；看门狗;工作温度范围:-40℃~+85℃;; LCSC Part Name: ARM Cortex-M4 170MHz 闪存：512K@x8bit RAM：128KB; Supplier Part: C431632; Manufacturer: ST(意法半导体); Supplier Footprint: LQFP-100; JLCPCB Part Class: 扩展库; Datasheet: https://atta.szlcsc.com/upload/public/pdf/source/20200902/C431632_38212262685EE30B1989689374F08940.pdf; Supplier: LCSC; CPU Core: ARM Cortex-M4; Maximum Frequency: 170MHz; Supply Voltage Range: 1.71V~3.6V; Internal Oscillator: 有; Program FLASH Size: 512K@x8bit; RAM Size: 128KB; GPIO Ports Number: 86; ADC (Units/Channels/bits): 1@x42ch/12bit; DAC (Units/Channels/bits): 1@x7ch/12bit; Peripherals / Functions / Protocol Stacks: DMA；PWM；看门狗; Operating Temperature Range: -40℃~+85℃
X1 = X50328MSB2GI: 频率:8MHz;负载电容:20pF;频率公差:±10ppm;; LCSC Part Name: 8MHz ±10ppm 20pF YSX530GA YSX530GA; Supplier Part: C115962; Manufacturer: YXC(扬兴晶振); Supplier Footprint: SMD5032-2P; JLCPCB Part Class: 基础库; Datasheet: https://atta.szlcsc.com/upload/public/pdf/source/20230220/0EBFFB9D6D8CE6A211407822BBB6C516.pdf; Supplier: LCSC; Crystal Type: 贴片无源晶振; Load Capacitance: 20pF; Frequency Tolerance: ±10ppm; Frequency Stability: ±50ppm; Operating Temperature: -40℃~+85℃
CN4 = DB128V-5.08-5P-GN-S: LCSC Part Name: 5.08mm 1x5P 排数:1 每排P数:5 直插; Supplier Part: C2927513; Manufacturer: DORABO(地博电气); Supplier Footprint: 插件,P=5.08mm; JLCPCB Part Class: 扩展库; Datasheet: https://atta.szlcsc.com/upload/public/pdf/source/20230106/CC449C10514519CDCE20F1C37DBF2DAC.pdf; Supplier: LCSC; Structure: 1x5P; Pitch: 5.08mm; Color: 绿色; Mounting Style: 直插; Current Rating (Max): 20A; Voltage Rating (Max): 300V; Number of Pins: 5P; Number of Rows: 1; Wire Gauge - AWG: 12~30; Wire Gauge - mm2: 2.5; Number of PINs Per Row: 5; Operating Temperature Range: -40℃~+105℃

## Nets
+3.3V: C4.2 C5.2 C6.2 C7.2 C8.2 C9.2 C10.2 C76.2 CN4.4 H1.1 L1.1 R38.2 U1.6(VBAT) U1.24(VDD) U1.49(VDD) U1.64(VDD) U1.75(VDD) U1.100(VDD) U10.18(VDRIVE)
+5V: C53.2 C73.2 C77.2 C79.2 CN4.2 U9.3(VCC) U10.43(AVDD) U25.4(V+) U26.4(V+) U27.8(V+)
+12V: C81.2 CN4.1 U24.8(VDD)
AGND: C1.2 C2.1 C3.2 C4.1 C5.1 C6.1 C7.1 C8.1 C9.1 C10.1 C11.1 C12.1 C53.1 C55.1 C56.1 C57.1 C59.1 C60.2 C61.2 C65.1 C68.1 C71.1 C72.2 C73.1 C74.1 C75.1 C76.1 C77.1 C78.1 C79.1 C80.1 C81.1 C86.1 C87.2 C88.1 CN4.5 H1.4 H2.3 R1.2 R47.1 R51.1 R64.1 R65.1 SW1.1 U1.23(VSS) U1.35(VSSA) U1.48(VSS) U1.63(VSS) U1.74(VSS) U1.99(VSS) U9.2(GND) U9.8(S) U10.5(DGND) U10.19(DGND) U10.40(AGND) U24.4(VSS) U24.9(EP) U25.11(V-) U26.11(V-) U27.4(V-)
A0: U1.91(PB4) U10.37(A0)
A1: U1.92(PB5) U10.36(A1)
CAN_RX: U1.72(PA11) U9.4(RXD)
CAN_TX: U1.73(PA12) U9.1(TXD)
CANH: H3.1 R37.2 U9.7(CANH)
CANL: H3.2 R37.1 U9.6(CANL)
COS: C58.1 R39.2 U10.45(COS) U26.14(OUT D)
COSLO: C63.1 R45.2 U10.44(COSLO) U26.8(OUT C)
CS#: U1.19(PF2) U10.2(CS#)
D+5V: C75.2 CN4.3 U10.6(DVDD)
DB13: U1.1(PE2) U10.13(DB13/SCLK)
DB14: U1.5(PE6) U10.12(DB14/SDI)
DB15: U1.4(PE5) U10.11(DB15/SDO)
DIR: U1.7(PC13) U10.32(DIR)
DOS: U1.97(PE0) U10.35(DOS)
EXC: R70.1 U10.38(EXC)
EXC#: R56.1 U10.39(EXC#)
LOT: U1.98(PE1) U10.34(LOT)
NRST: C2.2 SW1.2 U1.14(PG10-NRST)
OSC_IN: C1.1 U1.12(PF0-OSC_IN) X1.2(OSC2)
OSC_OUT: C3.1 U1.13(PF1-OSC_OUT) X1.1(OSC1)
RD#: U1.18(PC3) U10.3(RD#)
RES0: U1.21(PA1) U10.48(RES0)
RES1: U1.20(PA0) U10.1(RES1)
RESET#: U1.2(PE3) U10.33(RESET#)
RX: H2.2 U1.94(PB7)
SAMPLE#: U1.10(PF9) U10.10(SAMPLE#)
SIN: C84.1 R67.2 U10.41(SIN) U26.1(OUT A)
SINLO: C69.1 R55.2 U10.42(SINLO) U26.7(OUT B)
SOE#: U1.11(PF10) U10.9(SOE#)
SWCLK: H1.3 U1.77(PA14)
SWDIO: H1.2 U1.76(PA13)
TX: H2.1 U1.93(PB6)
VREF: C57.2 C71.2 C74.2 C80.2 U10.47(REFOUT) U25.3(+IN A) U25.5(+IN B) U25.10(+IN C) U25.12(+IN D) U26.3(+IN A) U26.5(+IN B) U26.10(+IN C) U26.12(+IN D) U27.3(+IN A) U27.5(+IN B)
WR#/FSYNC#: U1.17(PC2) U10.4(WR#/FSYNC#)
$1N2896: C11.2 C12.2 L1.2 U1.36(VREF+) U1.37(VDDA)
$1N3277: R1.1 U1.95(PB8-BOOT0)
$5N19775: R38.1 U9.5(VREF)
$6N5803: C55.2 C56.2 U10.46(REFBYP)
$6N5807: C54.2 R40.2 R42.2 U25.8(OUT C)
$6N5855: C66.1 R57.2 U27.2(-IN A)
$6N5857: C68.2 R54.1 R56.2 R57.1
$6N5858: C66.2 R54.2 R58.1 U27.1(OUT A)
$6N5861: C72.1 R58.2 U24.3(VINA+)
$6N5864: C64.2 R47.2 R51.2 R52.1 U24.2(VINA-)
$6N5868: C85.1 R71.2 U27.6(-IN B)
$6N5870: C86.2 R69.1 R70.2 R71.1
$6N5871: C85.2 R69.2 R75.1 U27.7(OUT B)
$6N5874: C87.1 R75.2 U24.5(VINB+)
$6N5877: C82.2 R64.2 R65.2 R66.1 U24.6(VINB-)
$6N5880: C64.1 CN2.5 R52.2 U24.1(VOUTA)
$6N5881: C82.1 CN2.6 R66.2 U24.7(VOUTB)
$6N9575: C88.2 R67.1 R72.2 R73.1
$6N9581: C78.2 R55.1 R60.2 R61.1
$6N9587: C65.2 R45.1 R48.2 R49.1
$6N9593: C59.2 R39.1 R41.2 R42.1
$6N9635: CN2.1 R44.2
$6N9636: R43.1 R44.1
$6N9679: CN2.2 R53.2
$6N9680: R50.1 R53.1
$6N9724: CN2.3 R63.2
$6N9725: R62.1 R63.1
$6N9769: CN2.4 R76.2
$6N9770: R74.1 R76.1
$6N13257: C60.1 U10.7(CLKIN) U13.1(OSC1)
$6N13266: C61.1 U10.8(XTALOUT) U13.2(OSC2)
$6N43759: C58.2 R41.1 U26.13(–IN D)
$6N43804: C69.2 R60.1 U26.6(–IN B)
$6N43807: C84.2 R72.1 U26.2(–IN A)
$6N44379: C63.2 R48.1 U26.9(–IN C)
$6N47243: C83.1 R68.1 R74.2 U25.6(–IN B)
$6N47251: C83.2 R68.2 R73.2 U25.7(OUT B)
$6N47317: C62.1 R46.1 R50.2 U25.13(–IN D)
$6N47327: C62.2 R46.2 R49.2 U25.14(OUT D)
$6N47391: C54.1 R40.1 R43.2 U25.9(–IN C)
$6N47423: C67.2 R59.2 R61.2 U25.1(OUT A)
$6N47431: C67.1 R59.1 R62.2 U25.2(–IN A)

Not connected (* = marked no-connect by the designer): U1 3(PE4)* 8(PC14-OSC32_IN)* 9(PC15-OSC32_OUT)* 15(PC0)* 16(PC1)* 22(PA2)* 25(PA3)* 26(PA4)* 27(PA5)* 28(PA6)* 29(PA7)* 30(PC4)* 31(PC5)* 32(PB0)* 33(PB1)* 34(PB2)* 38(PE7)* 39(PE8)* 40(PE9)* 41(PE10)* 42(PE11)* 43(PE12)* 44(PE13)* 45(PE14)* 46(PE15)* 47(PB10)* 50(PB11)* 51(PB12)* 52(PB13)* 53(PB14)* 54(PB15)* 55(PD8)* 56(PD9)* 57(PD10)* 58(PD11)* 59(PD12)* 60(PD13)* 61(PD14)* 62(PD15)* 65(PC6)* 66(PC7)* 67(PC8)* 68(PC9)* 69(PA8)* 70(PA9)* 71(PA10)* 78(PA15)* 79(PC10)* 80(PC11)* 81(PC12)* 82(PD0)* 83(PD1)* 84(PD2)* 85(PD3)* 86(PD4)* 87(PD5)* 88(PD6)* 89(PD7)* 90(PB3)* 96(PB9)*; U10 14(DB12)* 15(DB11)* 16(DB10)* 17(DB9)* 20(DB8)* 21(DB7)* 22(DB6)* 23(DB5)* 24(DB4)* 25(DB3)* 26(DB2)* 27(DB1)* 28(DB0)* 29(A)* 30(B)* 31(NM)*

## Notes on the sheets
sheet 1
- 时钟电路（未连接 OSC32_OUT）
- 复位电路
  (不连接上拉电阻）
- 注意预留相应输出引脚
- 供电电路（部分）
- 在 PCB 设计过程中， 电容必须尽可能接近相应的引脚。
- SWD调试电路
- 在 PCB 设计中，SWDIO与SWCLK
  需长度相等并进行隔离。
- USART接头
sheet 2
- 电源接口
- DC-DC 48V-12V
- 使用电源地GND。
  电源地GND与模拟地AGND之间使用单点连接。
- DC-DC 12V-5V
- LDO 5V-3.3V
sheet 3
- CAN模块
sheet 4
- 注意负载电容的选型
- AD2S1210可以直接输出2.5V参考电压？
